# Altium schematic sheet CANOPi_Baseboard_CAN.SchDoc
size A4; DocumentNumber: 3; SheetNumber: 3; SheetTotal: 5; CopyrightYear: 2021
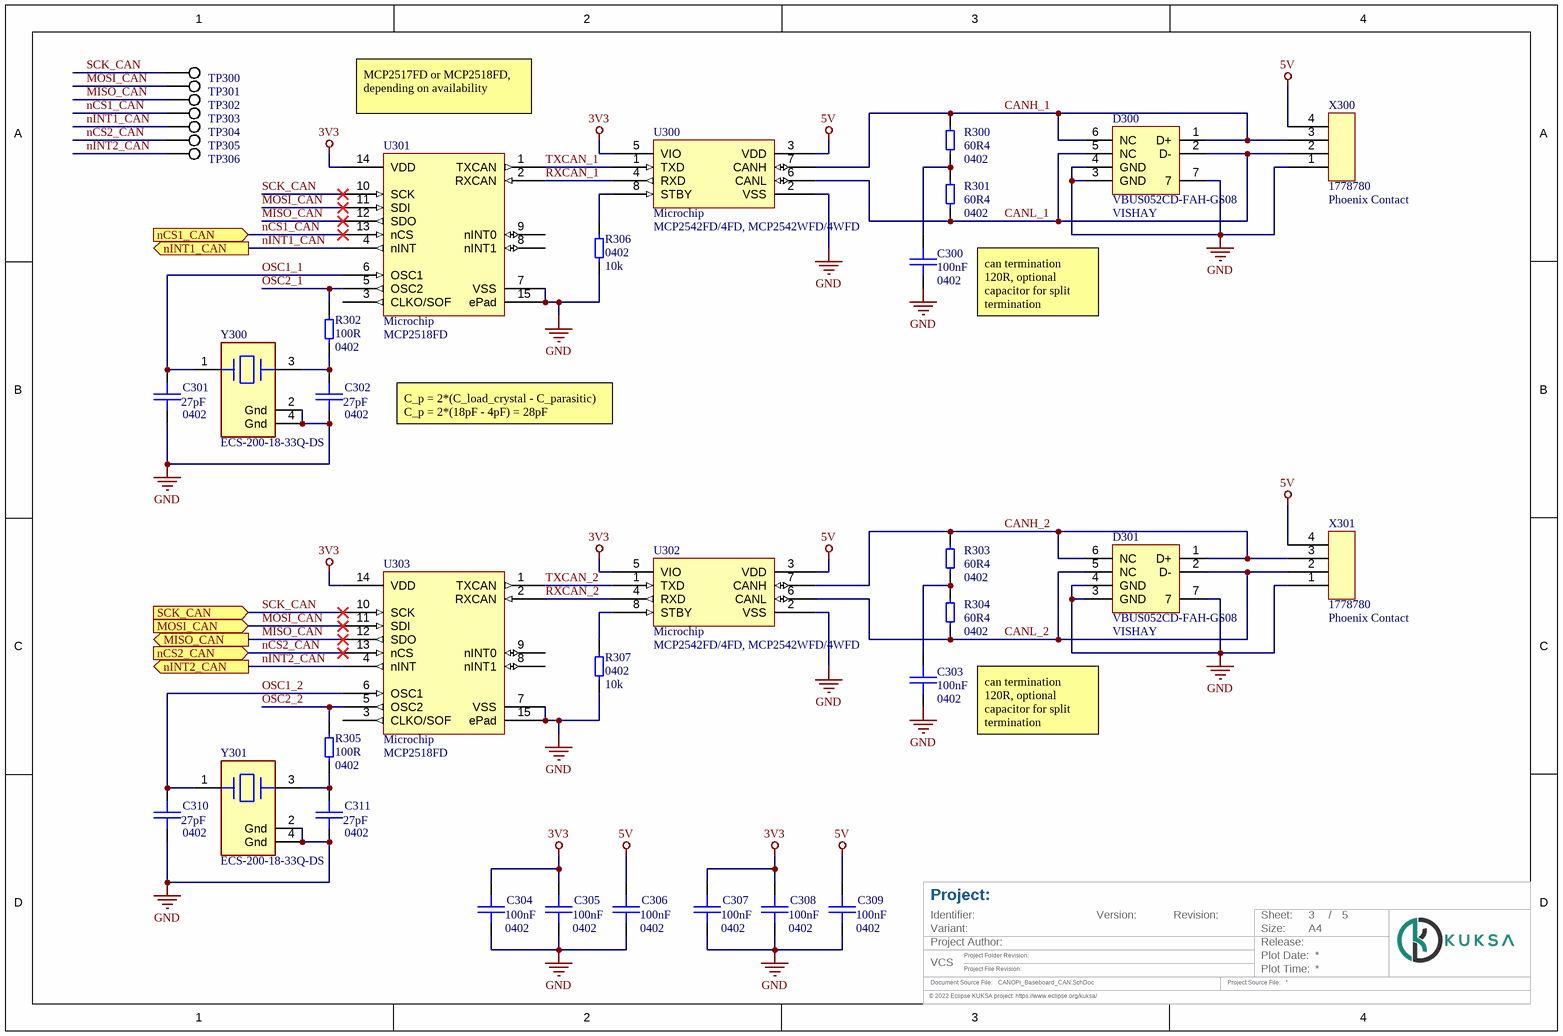
[diagram p0: CANOPi_Baseboard_CAN.SchDoc]

## Parts
C300  Capacitance: 100nF  Case: 0402  [CAP 0402 [1005 Metric] X050 N]  (hidden comment: CAP 0402 100n -10% +10% 6.3V X7R)
C301  Case: 0402  Capacitance: 27pF  [CAP 0402 [1005 Metric] X050 N]  (hidden comment: CAP 0402 27p -2% +2% 25V C0G)
C302  Case: 0402  Capacitance: 27pF  [CAP 0402 [1005 Metric] X050 N]  (hidden comment: CAP 0402 27p -2% +2% 25V C0G)
C303  Capacitance: 100nF  Case: 0402  [CAP 0402 [1005 Metric] X050 N]  (hidden comment: CAP 0402 100n -10% +10% 6.3V X7R)
C304  Capacitance: 100nF  Case: 0402  [CAP 0402 [1005 Metric] X050 N]  (hidden comment: CAP 0402 100n -10% +10% 6.3V X7R)
C305  Capacitance: 100nF  Case: 0402  [CAP 0402 [1005 Metric] X050 N]  (hidden comment: CAP 0402 100n -10% +10% 6.3V X7R)
C306  Capacitance: 100nF  Case: 0402  [CAP 0402 [1005 Metric] X050 N]  (hidden comment: CAP 0402 100n -10% +10% 6.3V X7R)
C307  Capacitance: 100nF  Case: 0402  [CAP 0402 [1005 Metric] X050 N]  (hidden comment: CAP 0402 100n -10% +10% 6.3V X7R)
C308  Capacitance: 100nF  Case: 0402  [CAP 0402 [1005 Metric] X050 N]  (hidden comment: CAP 0402 100n -10% +10% 6.3V X7R)
C309  Capacitance: 100nF  Case: 0402  [CAP 0402 [1005 Metric] X050 N]  (hidden comment: CAP 0402 100n -10% +10% 6.3V X7R)
C310  Case: 0402  Capacitance: 27pF  [CAP 0402 [1005 Metric] X050 N]  (hidden comment: CAP 0402 27p -2% +2% 25V C0G)
C311  Case: 0402  Capacitance: 27pF  [CAP 0402 [1005 Metric] X050 N]  (hidden comment: CAP 0402 27p -2% +2% 25V C0G)
D300  Manufacturer Part Number: VBUS052CD-FAH-GS08  Manufacturer: VISHAY  [VISHAY - VBUS052CD-FAH]  (hidden comment: VISHAY - VBUS052CD-FAH-GS08)
D301  Manufacturer Part Number: VBUS052CD-FAH-GS08  Manufacturer: VISHAY  [VISHAY - VBUS052CD-FAH]  (hidden comment: VISHAY - VBUS052CD-FAH-GS08)
R300  Resistance: 60R4  Case: 0402  [RES 0402 [1005 Metric]_N]  (hidden comment: RES 0402 60R4 1% 0W0625)
R301  Resistance: 60R4  Case: 0402  [RES 0402 [1005 Metric]_N]  (hidden comment: RES 0402 60R4 1% 0W0625)
R302  Resistance: 100R  Case: 0402  [RES 0402 [1005 Metric]_N]  (hidden comment: RES 0402 100R 1% 63mW)
R303  Resistance: 60R4  Case: 0402  [RES 0402 [1005 Metric]_N]  (hidden comment: RES 0402 60R4 1% 0W0625)
R304  Resistance: 60R4  Case: 0402  [RES 0402 [1005 Metric]_N]  (hidden comment: RES 0402 60R4 1% 0W0625)
R305  Resistance: 100R  Case: 0402  [RES 0402 [1005 Metric]_N]  (hidden comment: RES 0402 100R 1% 63mW)
R306  Case: 0402  Resistance: 10k  [RES 0402 [1005 Metric]_N]  (hidden comment: RES 0402 10K 1% 0W0625)
R307  Case: 0402  Resistance: 10k  [RES 0402 [1005 Metric]_N]  (hidden comment: RES 0402 10K 1% 0W0625)
TP300  Testpad, 0.8mm x 0.8mm, round  [Testpad, 0.8mm x 0.8mm, round]  (value not drawn)  (no BOM)
TP301  Testpad, 0.8mm x 0.8mm, round  [Testpad, 0.8mm x 0.8mm, round]  (value not drawn)  (no BOM)
TP302  Testpad, 0.8mm x 0.8mm, round  [Testpad, 0.8mm x 0.8mm, round]  (value not drawn)  (no BOM)
TP303  Testpad, 0.8mm x 0.8mm, round  [Testpad, 0.8mm x 0.8mm, round]  (value not drawn)  (no BOM)
TP304  Testpad, 0.8mm x 0.8mm, round  [Testpad, 0.8mm x 0.8mm, round]  (value not drawn)  (no BOM)
TP305  Testpad, 0.8mm x 0.8mm, round  [Testpad, 0.8mm x 0.8mm, round]  (value not drawn)  (no BOM)
TP306  Testpad, 0.8mm x 0.8mm, round  [Testpad, 0.8mm x 0.8mm, round]  (value not drawn)  (no BOM)
U300  Manufacturer: Microchip  Manufacturer Part Number: MCP2542FD/4FD, MCP2542WFD/4WFD  [SOIC127P600X175-8N]  (hidden comment: MICROCHIP - MCP2542FD/4FD)
U301  Manufacturer: Microchip  Manufacturer Part Number: MCP2518FD  [SON65P300X90_HS-15N]  (hidden comment: MICROCHIP - MCP2518FD)
U302  Manufacturer: Microchip  Manufacturer Part Number: MCP2542FD/4FD, MCP2542WFD/4WFD  [SOIC127P600X175-8N]  (hidden comment: MICROCHIP - MCP2542FD/4FD)
U303  Manufacturer: Microchip  Manufacturer Part Number: MCP2518FD  [SON65P300X90_HS-15N]  (hidden comment: MICROCHIP - MCP2518FD)
X300  Manufacturer Part Number: 1778780  Manufacturer: Phoenix Contact  [PHOENIX CONTACT - PTSM 0,5_ 4-HH-2,5-SMD R32-Footprint-1]  (hidden comment: PHOENIX CONTACT - PTSM 0,5/ 4-HH-2,5-SMD R32)
X301  Manufacturer Part Number: 1778780  Manufacturer: Phoenix Contact  [PHOENIX CONTACT - PTSM 0,5_ 4-HH-2,5-SMD R32-Footprint-1]  (hidden comment: PHOENIX CONTACT - PTSM 0,5/ 4-HH-2,5-SMD R32)
Y300  ECS-200-18-33Q-DS  [FP-ECX-33Q-MFG]
Y301  ECS-200-18-33Q-DS  [FP-ECX-33Q-MFG]

## Ports
MISO_CAN (out), MOSI_CAN (in), nCS1_CAN (in), nCS2_CAN (in), nINT1_CAN (out), nINT2_CAN (out), SCK_CAN (in)

## Nets
3V3: C304.2 C305.2 C307.2 C308.2 U300.5(VIO) U301.14(VDD) U302.5(VIO) U303.14(VDD)
5V: C306.2 C309.2 U300.3(VDD) U302.3(VDD) X300.4 X301.4
GND: C300.2 C301.1 C302.1 C303.2 C304.1 C305.1 C306.1 C307.1 C308.1 C309.1 C310.1 C311.1 D300.3(GND) D300.4(GND) D300.7 D301.3(GND) D301.4(GND) D301.7 R306.2 R307.2 U300.2(VSS) U301.7(VSS) U301.15(ePad) U302.2(VSS) U303.7(VSS) U303.15(ePad) X300.1 X301.1 Y300.2(Gnd) Y300.4(Gnd) Y301.2(Gnd) Y301.4(Gnd)
CANH_1: D300.1(D+) D300.6(NC) R300.2 U300.7(CANH) X300.3
CANH_2: D301.1(D+) D301.6(NC) R303.2 U302.7(CANH) X301.3
CANL_1: D300.2(D-) D300.5(NC) R301.1 U300.6(CANL) X300.2
CANL_2: D301.2(D-) D301.5(NC) R304.1 U302.6(CANL) X301.2
MISO_CAN: TP302.1 U301.12(SDO) U303.12(SDO) ; port MISO_CAN
MOSI_CAN: TP301.1 U301.11(SDI) U303.11(SDI) ; port MOSI_CAN
nCS1_CAN: TP303.1 U301.13(nCS) ; port nCS1_CAN
nCS2_CAN: TP305.1 U303.13(nCS) ; port nCS2_CAN
nINT1_CAN: TP304.1 U301.4(nINT) ; port nINT1_CAN
nINT2_CAN: TP306.1 U303.4(nINT) ; port nINT2_CAN
OSC1_1: C301.2 U301.6(OSC1) Y300.1(In/Out)
OSC1_2: C310.2 U303.6(OSC1) Y301.1(In/Out)
OSC2_1: R302.2 U301.5(OSC2)
OSC2_2: R305.2 U303.5(OSC2)
RXCAN_1: U300.4(RXD) U301.2(RXCAN)
RXCAN_2: U302.4(RXD) U303.2(RXCAN)
SCK_CAN: TP300.1 U301.10(SCK) U303.10(SCK) ; port SCK_CAN
TXCAN_1: U300.1(TXD) U301.1(TXCAN)
TXCAN_2: U302.1(TXD) U303.1(TXCAN)
NetC300_1: C300.1 R300.1 R301.2
NetC302_2: C302.2 R302.1 Y300.3(Out/In)
NetC303_1: C303.1 R303.1 R304.2
NetC311_2: C311.2 R305.1 Y301.3(Out/In)
NetR306_1: R306.1 U300.8(STBY)
NetR307_1: R307.1 U302.8(STBY)

Not connected (* = marked no-connect by the designer): U301 3(CLKO/SOF) 8(nINT1) 9(nINT0); U303 3(CLKO/SOF) 8(nINT1) 9(nINT0)

## Notes on the sheet
- MCP2517FD or MCP2518FD, depending on availability
- can termination 120R, optional capacitor for split termination
- C_p = 2*(C_load_crystal - C_parasitic) C_p = 2*(18pF - 4pF) = 28pF
- Project:
- Identifier:
- Version:
- Revision:
- Sheet:
- /
- VCS
- Variant:
- Document Source File:
- Project Author:
- Project Folder Revision:
- Project File Revision:
- Project Source File:
- Plot Date:
- Size:
- Plot Time:
- Release:
- A4
- © 2022 Eclipse KUKSA project. https://www.eclipse.org/kuksa/
- Drawn by:
- © Robert Bosch GmbH         . All rights reserved, also regarding any disposal, exploitation, reproduction, editing, distribution, as well as in the event of applications for industrial property rights.

## Library data of the parts
C300 C303-C309 = CMP-04212-4: SMD/SMT 0402 6.3V -10% +10% X7R - Multilayer Ceramic Capacitors MLCC; Manufacturer: MURATA; Manufacturer Part Number: GRM155R70J104KA01#; Capacitance Tolerance pos: 10%; Value: 100nF; Assembly: yes; Operating Temperature min: -55°C; Voltage Rating: 6.3V; Operating Temperature max: 125°C; ComponentLink1URL: http://psearch.en.murata.com/capacitor/lineup/grm/; IPC Footprint Naming: CAPC1005X050; Capacitance Tolerance neg: -10%; ComponentLink1Description: Datasheet; Dielectric Type: X7R; Mounting Type: SMT
C301 C302 C310 C311 = CMP-03814-4: SMD/SMT 0402 25V -2% +2% C0G - Multilayer Ceramic Capacitors MLCC; Manufacturer: MURATA; Manufacturer Part Number: GRM1555C1E270GA01#; Assembly: yes; Capacitance Tolerance pos: 2%; Value: 27pF; Dielectric Type: C0G (NP0); ComponentLink1Description: Datasheet; ComponentLink1URL: http://psearch.en.murata.com/capacitor/lineup/grm/; IPC Footprint Naming: CAPC1005X050; Voltage Rating: 25V; Operating Temperature min: -55°C; Mounting Type: SMT; Operating Temperature max: 125°C; Capacitance Tolerance neg: -2%
D300 D301 = CMP-04945-2: 2-Line BUS-Port ESD-Protection - Flow Through Design; ESD Voltage Contact: 0V; No. of Channels: 2; Breakdown Voltage: 7.9V; Assembly: yes; Mounting Type: SMT; Operating Temperature max: 125°C; Operating Temperature min: -40°C; Case: 6-UDFN; ComponentLink1Description: Datasheet; ComponentLink1URL: http://www.vishay.com/docs/81881/vbus052c.pdf; ESD Voltage Air: 0V
R300 R301 R303 R304 = CMP-00705-5: RC0402 series chip resistor with lead-free terminations made by thick film process; Manufacturer Part Number: RC0402FR-0760R4L; Manufacturer: YAGEO; Temperature Coefficient: ±100ppm/K; Current Rating: 1A; Power Rating: 62.5mW; Voltage Rating: 50V; Assembly: yes; Value: 60.4; ComponentLink1URL: http://www.yageo.com/documents/recent/PYu-RC0402_51_RoHS_L_6.pdf; Operating Temperature max: 155°C; ComponentLink1Description: Datasheet; Resistor Element Type: Thick Film; IPC Footprint Naming: RESC1005X04; Resistance Tolerance: 1%; Mounting Type: SMT; Operating Temperature min: -55°C
R302 R305 = CMP-06970-3: RC0402 series chip resistor with lead-free terminations made by thick film process; Manufacturer: ROHM; Manufacturer Part Number: MCR01MZPF100; Assembly: yes; Temperature Coefficient: ±100ppm/K; eADM Name: 8905501369; Voltage Rating: 50V; Value: 100; Current Rating: 1A; IPC Footprint Naming: RESC1005X04; Operating Temperature min: -55°C; Resistor Element Type: Thick Film; Resistance Tolerance: 1%; ComponentLink1URL: https://www.rohm.com/site-search?p_p_id=rohmsitesearch_WAR_rohmcomboportlet&p_p_lifecycle=1&p_p_state=normal&_rohmsitesearch_WAR_rohmcomboportlet_action=siteSearchAction&p_auth=xKaajgv6; ComponentLink1Description: Datasheet; Operating Temperature max: 155°C; Power Rating: 63mW; Mounting Type: SMT
R306 R307 = CMP-00958-6: RC0402 series chip resistor with lead-free terminations made by thick film process; Manufacturer Part Number: RC0402FR-0710KL; Manufacturer: YAGEO; Voltage Rating: 50V; Temperature Coefficient: ±100ppm/K; Assembly: yes; Current Rating: 1A; Power Rating: 62.5mW; Resistance Tolerance: 1%; Value: 10k; Resistor Element Type: Thick Film; ComponentLink1Description: Datasheet; IPC Footprint Naming: RESC1005X04; Mounting Type: SMT; ComponentLink1URL: http://www.yageo.com/documents/recent/PYu-RC0402_51_RoHS_L_6.pdf; Operating Temperature min: -55°C; Operating Temperature max: 155°C
TP300-TP306 = CMP-00390-13: Assembly: no; Case: 0.8x0.8mm, round
U300 U302 = CMP-11035-1: CAN FD Transceiver with Wake-up Pattern (WUP) Option; Supply Voltage min: 1,7V; Assembly: yes; Supply Voltage max: 5,5V; Case: SOIC-8; Mounting Type: SMD; ComponentLink1Description: Manufacturer Link; ComponentLink1URL: https://www.microchip.com/en-us/product/MCP2542FD; Operating Temperature min: -40°C; Operating Temperature max: 125°C; IC Interface Type: CAN FD Transceiver
U301 U303 = CMP-11034-4: CAN FD Controller with SPI Interface; Assembly: yes; Supply Voltage min: 2,7V; Number of RX Buffers: 31 RX/TX combined; Supply Voltage max: 5,5V; Operating Temperature min: -40°C; IC Interface Type: CAN FD Controller; Mounting Type: SMD; Case: VDFN14 with exposed pad; ComponentLink1Description: Manufacturer Link; Operating Temperature max: 150°C; ComponentLink1URL: https://www.microchip.com/en-us/product/MCP2518FD; Number of TX Buffers: 31 RX/TX combined
X300 X301 = CMP-11116-1: Leiterplatten-Grundleiste - PTSM 0,5/ 4-HH-2,5-SMD R32; Gender: Male; Assembly: yes; Voltage Rating: 160V; Pitch Spacing: 2,5mm; Current Rating: 6A; Operating Temperature min: -40°C; ComponentLink1Description: Manufacturer Link; Number of Pins: 4; ComponentLink1URL: https://www.phoenixcontact.com/online/portal/de/?uri=pxc-oc-itemdetail:pid=1778780&library=dede&pcck=P-11-02-11&tab=1&selectedCategory=ALL#Umgebungsbedingungen; Number of Rows: 1; Operating Temperature max: 100°C; Mounting Type: SMD
Y300 Y301 = CMP-40224-000004-1: CRYSTAL 20.0000MHZ 18PF SMD; Manufacturer: ECS International; Automotive Grade: Grade 1; Esr: 60Ω; Tolerance: 30ppm; Frequency: 20MHz; Stability: 100ppm; Digikey Description: CRYSTAL 20.0000MHZ 18PF SMD; ComponentLink2URL: https://ecsxtal.com/store/pdf/ECX-33Q.pdf; Device Class L1: Passive Components; Series: ECX-33Q; Temperature: -55°C to +125°C; Octopart: https://octopart.com/ecs-200-18-33q-ds-ecs+international-29290571; Height: 0.8mm; Category: Crys; Lead Free: Yes; Manufacturer Part Number: ECS-200-18-33Q-DS; ComponentLink2Description: Datasheet; Automotive: Yes; Temperature Range High: +125°C; Device Class L2: Crystals / Oscillators; Mouser Description: Crystals 20.000MHz 18pF 100ppm -40 to 125C; RoHS: TRUE; Load Capacitance: 18pF; Package: ECX-33Q; Temperature Range Low: -55°C; Device Class L3: Crystals